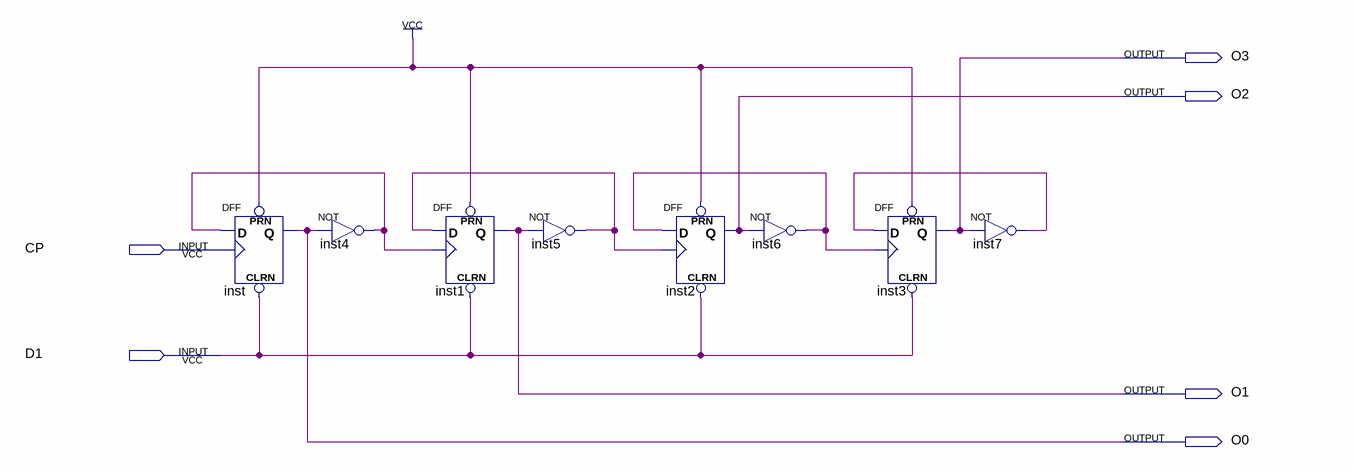
[diagram p0: schematic sheet]
// Quartus schematic counter.bdf as structural Verilog: 8 symbols, 6 pins
module counter (
  input  CP,
  input  D1,
  output O3,
  output O2,
  output O1,
  output O0
);

  wire inst4_out, inst5_out, inst6_out, inst7_out;

  DFF inst (.CLRN(D1), .CLK(CP), .D(inst4_out), .PRN(1'b1), .Q(O0));
  not inst4 (inst4_out, O0);
  DFF inst1 (.CLRN(D1), .CLK(inst4_out), .D(inst5_out), .PRN(1'b1), .Q(O1));
  not inst5 (inst5_out, O1);
  DFF inst2 (.CLRN(D1), .CLK(inst5_out), .D(inst6_out), .PRN(1'b1), .Q(O2));
  not inst6 (inst6_out, O2);
  DFF inst3 (.CLRN(D1), .CLK(inst6_out), .D(inst7_out), .PRN(1'b1), .Q(O3));
  not inst7 (inst7_out, O3);
endmodule
